# EAGLE board tides2_v40 (EAGLE 5.09)
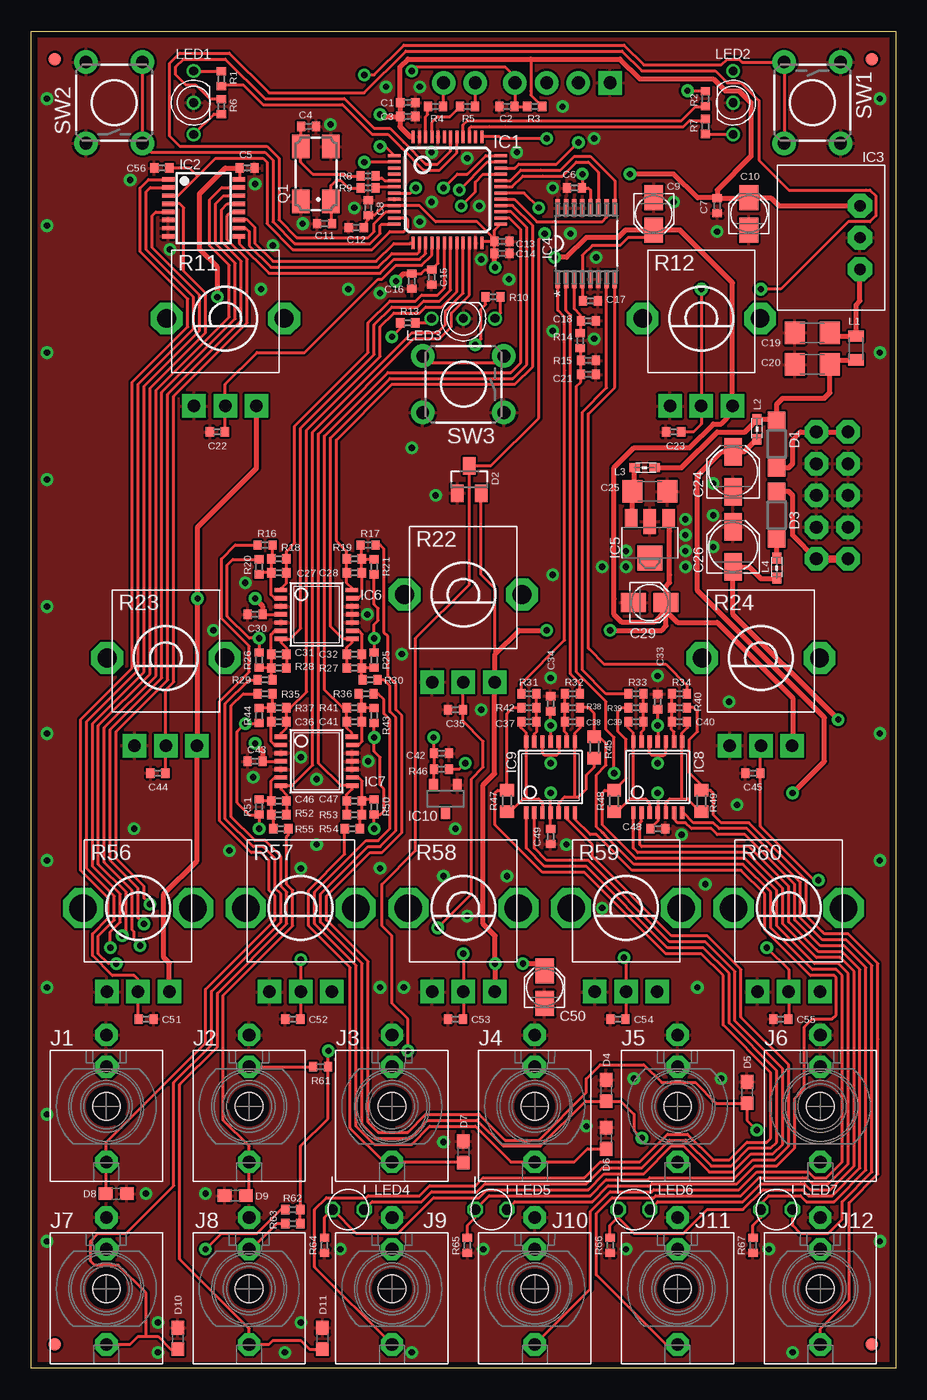
[diagram p5: board, top side]
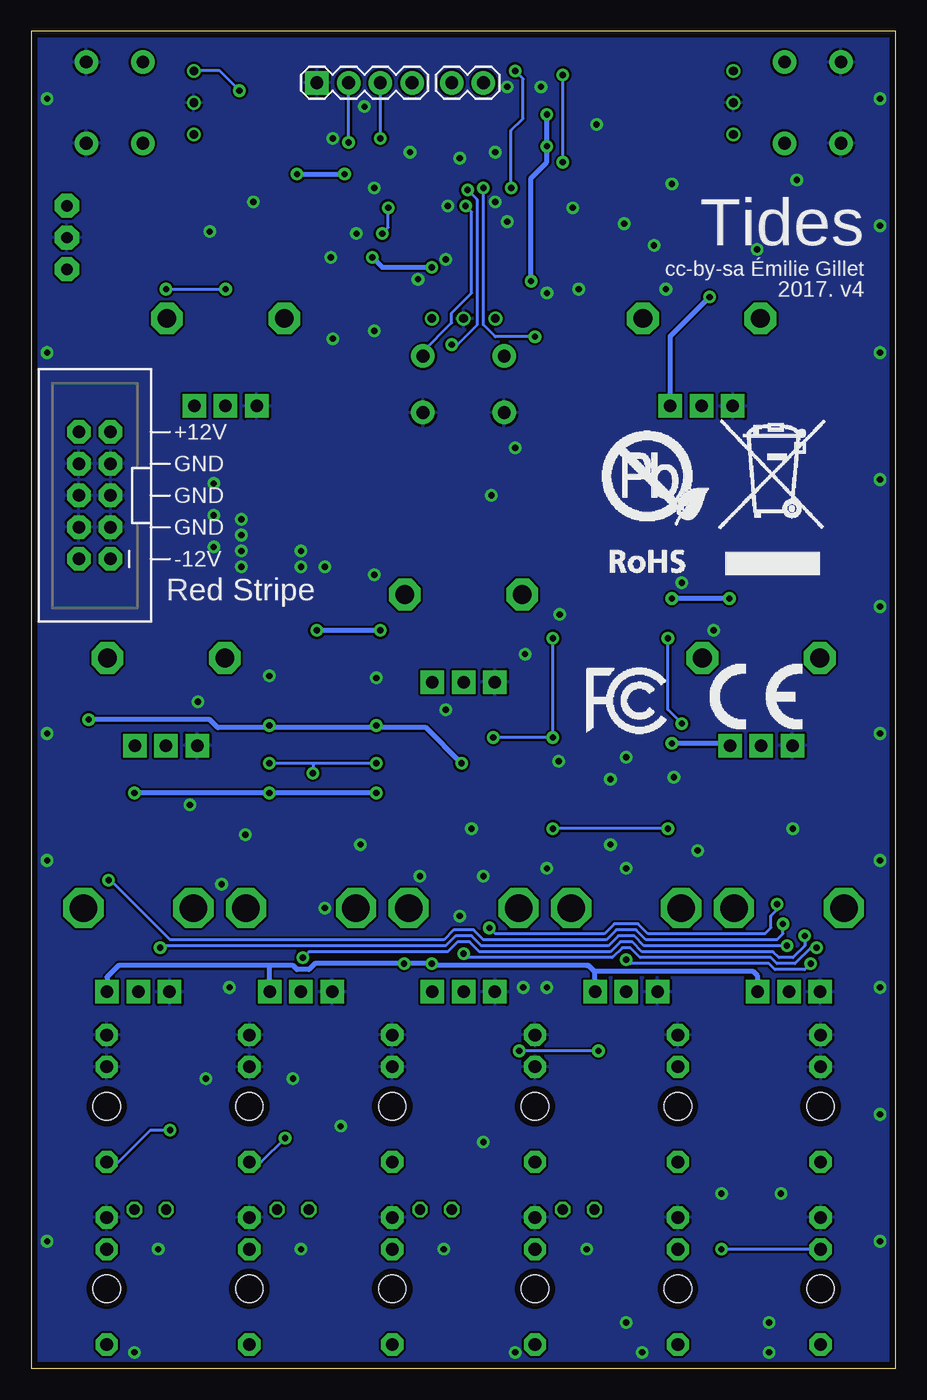
[diagram p6: board, bottom side, seen from below]

Size 69.2 x 107 mm. Coordinates in mm from the lower left corner, seen from the top.
Outline: 69.2,0 0,0 0,107 69.2,107 69.2,0
Copper layers (1*16): Top 0.035mm / dielectric 1.5mm / Bottom 0.035mm
Design rules "PCBCart-Standard": minimum track width 8mil, minimum drill 0.4mm, track to track 7mil, track to pad 7mil, pad to pad 7mil, via to via 7mil, smd to smd 7mil, copper to edge 20mil, drill to drill 8mil, minimum pad ring 8mil, minimum via ring 10mil, stop-mask expansion 3mil, vias tented up to drill 25mil, thermal gap 8mil

## Footprints (pad centres in the part's own frame; a part is rotated, then mirrored left to right if it is on the bottom)
C0402 = smd 0.65 x 0.75: 1 -0.6,0; 2 0.6,0
PANASONIC_A = smd 2 x 1.5: + 1.3,0; - -1.3,0
C1206 = smd 1.6 x 1.8: 1 -1.4,0; 2 1.4,0
PANASONIC_B = smd 2.2 x 1.4: + 1.6,0; - -1.6,0
SOD123 = smd 1.4 x 1.4: A 1.9,0; C -1.9,0
SOT23 = smd 1 x 1.4: 1 -0.95,-1.1; 2 0.95,-1.1; 3 0,1.1
0603 = smd 1.1 x 1: 1 -0.85,0; 2 0.85,0
LQFP48 = smd 0.254 x 1: 1 -2.75,-4.25; 2 -2.25,-4.25; 3 -1.75,-4.25; 4 -1.25,-4.25; 5 -0.75,-4.25; 6 -0.25,-4.25; 7 0.25,-4.25; 8 0.75,-4.25; 9 1.25,-4.25; 10 1.75,-4.25; 11 2.25,-4.25; 12 2.75,-4.25; 25 2.75,4.25; 26 2.25,4.25; 27 1.75,4.25; 28 1.25,4.25; 29 0.75,4.25; 30 0.25,4.25; 31 -0.25,4.25; 32 -0.75,4.25; 33 -1.25,4.25; 34 -1.75,4.25; 35 -2.25,4.25; 36 -2.75,4.25 | smd 1 x 0.254: 13 4.25,-2.75; 14 4.25,-2.25; 15 4.25,-1.75; 16 4.25,-1.25; 17 4.25,-0.75; 18 4.25,-0.25; 19 4.25,0.25; 20 4.25,0.75; 21 4.25,1.25; 22 4.25,1.75; 23 4.25,2.25; 24 4.25,2.75; 37 -4.25,2.75; 38 -4.25,2.25; 39 -4.25,1.75; 40 -4.25,1.25; 41 -4.25,0.75; 42 -4.25,0.25; 43 -4.25,-0.25; 44 -4.25,-0.75; 45 -4.25,-1.25; 46 -4.25,-1.75; 47 -4.25,-2.25; 48 -4.25,-2.75
TSSOP16_065 = smd 0.35 x 1: 1 -1.95,-2.825; 2 -1.3,-2.825; 3 -0.65,-2.825; 4 0,-2.825; 5 0.65,-2.825; 6 1.3,-2.825; 7 1.95,-2.825; 8 2.6,-2.825; 9 2.6,2.825; 10 1.95,2.825; 11 1.3,2.825; 12 0.65,2.825; 13 0,2.825; 14 -0.65,2.825; 15 -1.3,2.825; 16 -1.95,2.825
WE78 = drill 0.9 pad 1.93 octagon: 1 -2.54,0; 2 0,0; 3 2.54,0
SOP65P640X110-16N = smd 1.422 x 0.356: 1 -2.845,2.286; 2 -2.845,1.626; 3 -2.845,0.965; 4 -2.845,0.33; 5 -2.845,-0.33; 6 -2.845,-0.965; 7 -2.845,-1.626; 8 -2.845,-2.286; 9 2.845,-2.286; 10 2.845,-1.626; 11 2.845,-0.965; 12 2.845,-0.33; 13 2.845,0.33; 14 2.845,0.965; 15 2.845,1.626; 16 2.845,2.286
SOT89 = smd 1 x 1.5: 1 -1.499,-1.981; 3 1.499,-1.981 | smd 1 x 2: 2 0,-1.727 | smd 2 x 2: 2@1 0,1.194
TSSOP14_065 = smd 0.35 x 1: 1 -1.95,-2.845; 2 -1.3,-2.845; 3 -0.65,-2.845; 4 0,-2.845; 5 0.65,-2.845; 6 1.3,-2.845; 7 1.95,-2.845; 8 1.95,2.845; 9 1.3,2.845; 10 0.65,2.845; 11 0,2.845; 12 -0.65,2.845; 13 -1.3,2.845; 14 -1.95,2.825
DBZ_R-PDSO-G3 = smd 0.7 x 1: 1 -0.95,-1.1; 2 0.95,-1.1; 3 0,1.1
WQP_PJ_301M6 = drill 1.016 pad 1.778 octagon: P1 0,-5.715; P2 0,-3.175; P3 0,4.445 | hole 2.2: 0,0
FIDUCIAL-1X2 = smd 1 x 1: 1 0,0
2X5-SHROUDED = drill 1.016 pad 1.88 octagon: 1 -1.27,5.08; 2 1.27,5.08; 3 -1.27,2.54; 4 1.27,2.54; 5 -1.27,0; 6 1.27,0; 7 -1.27,-2.54; 8 1.27,-2.54; 9 -1.27,-5.08; 10 1.27,-5.08
1X04 = drill 1.016 pad 1.88 square: 1 0,0 | drill 1.016 pad 1.88: 2 2.54,0; 3 5.08,0; 4 7.62,0
1X02 = drill 1.016 pad 1.88: 1 0,0; 2 2.54,0
L2012C = smd 0.9 x 1.25: 1 -0.9,0; 2 1,0
0603' = smd 0.85 x 0.7: 1 -0.9,0; 2 0.7,0
LED-BICOLOR-THROUGHHOLE-2.54 = drill 0.7: 1 -2.54,0; 2 0,0; 3 2.54,0
LED3MM = drill 0.813 octagon: 1 -1.27,0; 2 1.27,0
CTS406 = smd 1.9 x 1.4: 1 -2.2,-1.2; 2 2.2,-1.2; 3 2.2,1.2; 4 -2.2,1.2
R0402 = smd 0.65 x 0.75: 1 -0.6,0; 2 0.6,0
ALPS_POT_VERTICAL_PS = drill 1 pad 1.88 square: P$1 -2.5,7; P$2 0,7; P$3 2.5,7 | drill 1.5 pad 2.54 octagon: P$4 -4.7,0; P$5 4.7,0
R0603 = smd 1 x 1.1: 1 -0.85,0; 2 0.85,0
ALPS_POT_VERTICAL = drill 1 pad 1.88 square: P$1 -2.5,6.7; P$2 0,6.7; P$3 2.5,6.7 | drill 2.2 pad 3.175 octagon: P$4 -4.4,0; P$5 4.4,0
TACTILE-PTH = drill 1.016 pad 1.88: 1 -3.251,2.261; 2 3.251,2.261; 3 -3.251,-2.261; 4 3.251,-2.261

## Placement (x,y rotation side)
C1  1u  [C0402]  30.14,101.28 0 top
C2  100n  [C0402]  38.08,100.97 180 top
C3  100n  [C0402]  30.14,100.17 0 top
C4  20p  [C0402]  22.2,99.38 180 top
C5  100n  [C0402]  17.28,96.04 0 top
C6  100n  [C0402]  43.48,94.46 180 top
C7  100n  [C0402]  54.91,93.03 270 top
C8  100n  [C0402]  26.97,92.87 90 top
C9  10u  [PANASONIC_A]  49.83,92.39 270 top
C10  10u  [PANASONIC_A]  57.45,92.39 90 top
C11  20p  [C0402]  23.47,91.6 0 top
C12  1u  [C0402]  26.02,91.28 180 top
C13  1u  [C0402]  37.68,90.17 0 top
C14  100n  [C0402]  37.68,89.22 0 top
C15  100n  [C0402]  32.05,87.31 270 top
C16  1u  [C0402]  30.46,86.99 270 top
C17  100n  [C0402]  44.75,85.41 0 top
C18  1u  [C0402]  44.59,83.82 0 top
C19  22u  [C1206]  62.53,82.87 180 top
C20  22u  [C1206]  62.53,80.33 180 top
C21  1u  [C0402]  44.59,79.53 0 top
C22  100n  [C0402]  14.9,74.93 180 top
C23  100n  [C0402]  51.41,74.93 180 top
C24  22u  [PANASONIC_B]  56.18,71.75 90 top
C25  22u  [C1206]  49.51,70.17 0 top
C26  22u  [PANASONIC_B]  56.18,65.72 90 top
C27  100p  [C0402]  19.82,63.66 0 top
C28  1.0n  [C0402]  25.86,63.66 180 top
C29  10u  [PANASONIC_A]  49.51,61.28 0 top
C30  100n  [C0402]  17.92,60.33 180 top
C31  100p  [C0402]  19.82,57.15 0 top
C32  1.0n  [C0402]  25.86,57.15 180 top
C33  100n  [C0402]  50.14,53.34 270 top
C34  100n  [C0402]  41.57,53.18 270 top
C35  100n  [C0402]  33.95,52.7 180 top
C36  100p  [C0402]  19.82,51.75 0 top
C37  47p  [C0402]  39.83,51.75 180 top
C38  47p  [C0402]  43.32,51.75 0 top
C39  47p  [C0402]  48.4,51.75 180 top
C40  47p  [C0402]  51.89,51.75 0 top
C41  1.0n  [C0402]  25.86,51.75 180 top
C42  1u  [C0402]  32.84,49.21 0 top
C43  100n  [C0402]  17.92,48.58 180 top
C44  100n  [C0402]  10.14,47.62 180 top
C45  100n  [C0402]  57.76,47.62 180 top
C46  1.0n  [C0402]  19.82,45.4 0 top
C47  1.0n  [C0402]  25.86,45.4 180 top
C48  100n  [C0402]  50.14,43.18 0 top
C49  100n  [C0402]  41.57,42.55 270 top
C50  10u  [PANASONIC_A]  41.1,30.48 90 top
C51  100n  [C0402]  9.19,27.94 0 top
C52  100n  [C0402]  20.93,27.94 180 top
C53  100n  [C0402]  33.95,27.94 180 top
C54  100n  [C0402]  46.97,27.94 180 top
C55  100n  [C0402]  59.99,27.94 180 top
C56  1.0n  [C0402]  10.46,96.04 180 top
D1  1N5819HW  [SOD123]  59.67,73.98 270 top
D2  BAT54S  [SOT23]  35.06,71.12 0 top
D3  1N5819HW  [SOD123]  59.67,68.26 270 top
D4  TVS  [0603]  46.02,22.23 270 top
D5  TVS  [0603]  57.29,22.07 270 top
D6  TVS  [0603]  46.02,18.41 270 top
D7  TVS  [0603]  34.59,17.3 270 top
D8  TVS  [0603]  6.81,13.97 180 top
D9  TVS  [0603]  16.33,13.81 0 top
D10  TVS  [0603]  11.73,2.38 270 top
D11  TVS  [0603]  23.32,2.38 270 top
IC1  STM32F373CCT6  [LQFP48]  33.32,94.3 270 top
IC2  4051PW  [TSSOP16_065]  13.79,93.19 270 top
IC3  R-78E3.3-0.5  [WE78]  66.34,90.49 90 top
IC4  DAC8164ICPW  [SOP65P640X110-16N]  44.43,90.01 90 top
IC5  LD2981ABU33  [SOT89]  49.51,66.04 180 top
IC6  MCP6004  [TSSOP14_065]  22.84,60.33 270 top
IC7  MCP6004  [TSSOP14_065]  22.84,48.58 270 top
IC8  TLV4172  [TSSOP14_065]  50.14,47.31 0 top
IC9  TLV4172  [TSSOP14_065]  41.57,47.31 0 top
IC10  LM4040B10  [DBZ_R-PDSO-G3]  33.16,45.56 180 top
J1  PJ301_THONKICONN6  [WQP_PJ_301M6]  6.01,20.95 180 top
J2  PJ301_THONKICONN6  [WQP_PJ_301M6]  17.44,20.95 180 top
J3  PJ301_THONKICONN6  [WQP_PJ_301M6]  28.87,20.95 180 top
J4  PJ301_THONKICONN6  [WQP_PJ_301M6]  40.3,20.95 180 top
J5  PJ301_THONKICONN6  [WQP_PJ_301M6]  51.73,20.95 180 top
J6  PJ301_THONKICONN6  [WQP_PJ_301M6]  63.16,20.95 180 top
J7  PJ301_THONKICONN6  [WQP_PJ_301M6]  6.01,6.35 180 top
J8  PJ301_THONKICONN6  [WQP_PJ_301M6]  17.44,6.35 180 top
J9  PJ301_THONKICONN6  [WQP_PJ_301M6]  28.87,6.35 180 top
J10  PJ301_THONKICONN6  [WQP_PJ_301M6]  40.3,6.35 180 top
J11  PJ301_THONKICONN6  [WQP_PJ_301M6]  51.73,6.35 180 top
J12  PJ301_THONKICONN6  [WQP_PJ_301M6]  63.16,6.35 180 top
JP1  FIDUCIAL1X2  [FIDUCIAL-1X2]  1.89,104.78 0 top
JP2  FIDUCIAL1X2  [FIDUCIAL-1X2]  67.29,104.77 0 top
JP3  FIDUCIAL1X2  [FIDUCIAL-1X2]  1.89,1.91 0 top
JP4  FIDUCIAL1X2  [FIDUCIAL-1X2]  67.29,1.91 0 top
JP5  M05X2SHD  [2X5-SHROUDED]  64.12,69.85 180 bottom
JP6  [1X04]  46.33,102.87 0 bottom
JP7  [1X02]  33,102.87 180 bottom
L1  33u  [L2012C]  66.02,81.6 90 top
L2  [0603']  58.08,75.25 90 top
L3  [0603']  49.19,72.07 0 top
L4  [0603']  59.67,64.14 90 top
LED1  W115WSURKMGKW  [LED-BICOLOR-THROUGHHOLE-2.54]  13,101.28 90 top
LED2  W115WSURKMGKW  [LED-BICOLOR-THROUGHHOLE-2.54]  56.18,101.28 270 top
LED3  W115WSURKMGKW  [LED-BICOLOR-THROUGHHOLE-2.54]  34.59,84.01 180 top
LED4  3BC-F  [LED3MM]  25.38,12.7 180 top
LED5  3BC-F  [LED3MM]  36.81,12.7 180 top
LED6  3BC-F  [LED3MM]  48.24,12.7 180 top
LED7  3BC-F  [LED3MM]  59.67,12.7 180 top
Q1  8MHz  [CTS406]  22.79,95.57 90 top
R1  2.4k  [R0402]  15.22,103.19 90 top
R2  1.5k  [R0402]  53.95,101.6 90 top
R3  10k  [R0402]  40.3,100.97 180 top
R4  100  [R0402]  32.36,100.97 180 top
R5  100  [R0402]  34.9,100.97 180 top
R6  1.5k  [R0402]  15.22,100.97 270 top
R7  2.4k  [R0402]  53.95,99.38 270 top
R8  100  [R0402]  26.97,95.41 180 top
R9  100  [R0402]  26.97,94.46 180 top
R10  1.5k  [R0402]  36.97,85.73 0 top
R11  10kB  [ALPS_POT_VERTICAL_PS]  15.54,84.01 180 top
R12  10kB  [ALPS_POT_VERTICAL_PS]  53.64,84.01 180 top
R13  2.4k  [R0402]  30.14,83.66 0 top
R14  130k  [R0402]  43.95,82.23 90 top
R15  100k  [R0402]  44.59,80.64 180 top
R16  100k  [R0402]  18.71,65.88 180 top
R17  100k  [R0402]  26.97,65.88 0 top
R18  20k  [R0402]  19.82,64.77 180 top
R19  20k  [R0402]  25.86,64.77 0 top
R20  120k  [R0402]  18.24,64.14 90 top
R21  120k  [R0402]  27.44,64.14 270 top
R22  10kB  [ALPS_POT_VERTICAL_PS]  34.59,61.91 180 top
R23  10kB  [ALPS_POT_VERTICAL_PS]  10.78,56.83 180 top
R24  10kB  [ALPS_POT_VERTICAL_PS]  58.4,56.83 180 top
R25  120k  [R0402]  27.44,56.67 90 top
R26  390k  [R0402]  18.24,56.67 90 top
R27  20k  [R0402]  25.86,56.04 0 top
R28  130k  [R0402]  19.82,56.04 180 top
R29  100k  [R0402]  18.71,55.09 180 top
R30  100k  [R0402]  27.13,55.09 0 top
R31  20k  [R0402]  39.83,53.98 180 top
R32  20k  [R0402]  43.32,53.98 0 top
R33  20k  [R0402]  48.4,53.98 180 top
R34  20k  [R0402]  51.89,53.98 0 top
R35  100k  [R0402]  18.71,53.97 180 top
R36  100k  [R0402]  26.81,53.97 0 top
R37  130k  [R0402]  19.82,52.86 180 top
R38  130k  [R0402]  43.32,52.86 180 top
R39  130k  [R0402]  48.4,52.86 0 top
R40  130k  [R0402]  51.89,52.86 180 top
R41  20k  [R0402]  25.86,52.86 0 top
R42  130k  [R0402]  39.83,52.86 0 top
R43  120k  [R0402]  27.44,52.23 270 top
R44  390k  [R0402]  18.24,52.23 270 top
R45  1.0k  [R0603]  45.06,49.69 270 top
R46  1.5k  [R0402]  32.84,47.94 180 top
R47  1.0k  [R0603]  38.08,45.4 270 top
R48  1.0k  [R0603]  46.65,45.4 270 top
R49  1.0k  [R0603]  53.64,45.4 270 top
R50  140k  [R0402]  27.44,44.93 270 top
R51  120k  [R0402]  18.24,44.93 270 top
R52  20k  [R0402]  19.82,44.29 180 top
R53  33k  [R0402]  25.86,44.29 0 top
R54  100k  [R0402]  25.7,43.18 180 top
R55  100k  [R0402]  19.98,43.18 0 top
R56  10kB  [ALPS_POT_VERTICAL]  8.55,36.83 180 top
R57  10kB  [ALPS_POT_VERTICAL]  21.57,36.83 180 top
R58  10kB  [ALPS_POT_VERTICAL]  34.59,36.83 180 top
R59  10kB  [ALPS_POT_VERTICAL]  47.6,36.83 180 top
R60  10kB  [ALPS_POT_VERTICAL]  60.62,36.83 180 top
R61  10k  [R0402]  23.16,24.13 0 top
R62  10k  [R0402]  20.94,12.7 0 top
R63  10k  [R0402]  20.94,11.59 0 top
R64  1.0k  [R0402]  23.48,9.84 270 top
R65  1.0k  [R0402]  34.9,9.84 270 top
R66  1.0k  [R0402]  46.33,9.84 270 top
R67  1.0k  [R0402]  57.76,9.84 270 top
SW1  [TACTILE-PTH]  62.53,101.28 270 top
SW2  [TACTILE-PTH]  6.65,101.28 90 top
SW3  [TACTILE-PTH]  34.59,78.74 180 top
U$2  [ROHS_BIG]  24.74,62.71 0 bottom
U$4  [CE_MEDIUM]  14.9,51.12 0 bottom
U$5  [FCC_MEDIUM]  24.75,50.8 0 bottom

## Tracks (layer width: path | path; a pad name or v marks a point on that pad's centre or on a via)
+3V3  (via drill 0.5)
  Top 0.254: 30.34,98.55 IC1.48 | v44.11,95.57 44.11,94.49 C6.1 44.59,94.46 44.76,94.28 IC4.12 | IC1.1 28.32,97.79 v27.92,97.79 | 30.43,87.63 C16.1 31.22,87.59 31.54,87.91 C15.1 32.57,88.43 IC1.17 | 39.98,104.78 39.98,102.23 39.98,101.88 R3.1
  Top 0.406: C7.1 54.91,94.3 57.61,97 57.61,101.28 56.65,102.23 55.54,102.23 54.59,103.19 48.72,103.19 47.13,104.78 39.98,104.78 30.14,104.78 29.51,104.14 29.51,101.32 C1.1 C3.1 | C7.1 57.38,93.63 C10.+ 57.48,93.66 59.19,93.66 59.83,93.03 IC3.3 | C3.1 29.51,100.14 29.51,99.38 30.34,98.55 | C7.1 54.87,93.66 53.32,93.66 51.41,95.57 v47.92,95.57 | v27.92,100.33 28.08,100.17 C3.1 | v29.19,87 29.79,87.59 C16.1
  Bottom 0.406: v47.92,95.57 v44.11,95.57 | v27.92,100.33 v27.92,97.79 27.92,96.52 29.19,95.25 v29.19,87
+3V3_A  (via drill 0.5)
  Top 0.254: C30.1 IC6.4 | IC1.25 37.08,91.06 C13.1 | IC1.24 36.19,90.17 C13.1 | C14.1 C13.1 | C13.1 37.08,90.38 35.7,91.76 32.36,91.76 31.09,93.03 29.09,93.03 IC1.9 28.26,93.05 27.48,92.27 C8.1 26.97,91.92 26.81,91.76 26.81,91.47 C12.1 | 44.11,87.18 IC4.4 | D2.2 36.02,63.5 37.13,62.39 37.13,55.4 | C43.1 IC7.4 | IC2.16 16.68,95.2 C5.1 | 44.11,87.18 IC4.4 | C17.1 44.1,85.45 IC4.4 | 44.11,87.18 IC4.4 | 44.11,87.18 44.11,89.06 44.91,89.85 47.13,89.85 47.76,90.49 48.88,90.49 49.83,90.49 C9.+
  Top 0.406: R24.P$1 60.94,49.87 60.94,53.66 54.91,59.69 51.73,59.69 50.81,60.61 | v46.33,59.05 | v41.25,59.05 39.03,59.05 37.13,57.15 37.13,55.4 37.13,54.95 R22.P$1 37.09,47.59 36.17,46.67 36.17,35.56 37.13,34.61 v37.13,32.38 37.13,30.17 R58.P$1 | C50.+ 40.49,32.38 v39.35,32.38 | v17.92,61.59 18.52,60.99 C30.1 | v37.13,88.11 37.08,88.15 C14.1 | R56.P$1 11.05,32.42 10.62,32.86 10.62,37.94 13.28,40.6 R23.P$1 13.32,49.87 v13.32,61.59 13.32,67.31 18.04,72.03 R11.P$1 | v14.9,85.72 14.9,88.11 13.47,89.53 13.47,93.98 15.54,96.04 C5.1 | v17.92,50.01 18.52,49.41 C43.1 | v41.89,88.9 42.84,88.9 44.43,90.49 46.97,90.49 47.57,91.09 C9.+ 51.92,91.09 56.14,86.88 R12.P$1 56.14,76.48 55.22,75.56 54.59,75.56 52.68,73.66 48.24,73.66 46.65,72.07 46.65,61.59 46.65,60.33 47.29,59.69 49.83,59.69 50.81,60.67 C29.+ | IC5.1 51.1,68.02 51.1,66.99 51.1,63.5 51.1,62.87 50.81,62.58 C29.+ | 50.81,60.61 C29.+ | v46.33,59.05 50.46,59.05 50.81,59.4 50.81,60.61
  Bottom 0.406: v41.25,59.05 v46.33,59.05 | 50.14,32.23 48.24,32.23 47.92,31.91 46.97,31.91 46.49,32.38 v39.35,32.38 v37.13,32.38 36.97,32.23 24.75,32.23 | 50.14,32.23 62.21,32.23 63.12,31.31 R60.P$1 | R59.P$1 50.14,30.17 50.14,32.23 | 18.04,61.71 v17.92,61.59 v13.32,61.59 | v17.92,50.01 | v41.89,88.9 41.1,88.11 v37.13,88.11 | v14.9,85.72 18.04,82.59 R11.P$1 | 24.11,31.75 11.41,31.75 11.05,31.39 R56.P$1 | 24.75,32.23 | 24.11,31.75 24.59,32.23 24.75,32.23 | R57.P$1 24.11,30.17 24.11,31.75 | v17.92,50.01 13.95,50.01 13.78,49.83 R23.P$1
ADC_CLOCK
  Top 0.254: IC1.20 34.07,86.16 32.84,84.93 31.57,84.93 31.09,84.45 29.03,84.45 27.92,83.34 27.92,80.96 22.05,75.09 22.05,54.13 20.78,52.86 R37.1 C36.2 20.42,51.24 20,50.81 IC7.1
ADC_FM
  Top 0.254: R52.1 C46.2 20.46,45.44 20.46,45.88 20,46.34 IC7.7 20.89,46.63 22.52,48.26 22.52,74.93 30.46,82.87 32.52,82.87 33.16,83.5 33.16,84.61 34.57,86.02 IC1.21
ADC_SHAPE
  Top 0.254: R27.1 | R27.1 C32.2 25.26,57.66 25.68,58.09 IC6.8 24.95,58.38 23.95,59.37 23.95,74.45 28.71,79.22 38.56,79.22 39.67,80.33 39.67,91.28 38.4,92.55 IC1.27
ADC_SHIFT
  Top 0.254: R19.1 25.22,64.81 | R19.1 C28.2 25.26,62.83 25.66,62.42 IC6.14 | IC1.28 38.54,93.05 40.14,91.44 40.14,80.17 38.71,78.74 28.87,78.74 24.43,74.3 24.43,66.2 25.26,65.37 R19.1
ADC_SLOPE
  Top 0.254: R18.1 20.46,64.81 | R18.1 C27.2 20.42,62.83 20,62.4 IC6.1 | IC1.18 33.07,86.43 32.52,85.88 31.25,85.88 30.78,85.41 28.71,85.41 26.97,83.66 26.97,81.28 21.25,75.56 21.09,75.41 21.09,66.04 20.42,65.37 R18.1
ADC_SMOOTHNESS
  Top 0.254: R41.1 | R41.1 24.9,52.86 23.48,54.29 23.48,74.61 28.55,79.69 38.4,79.69 39.19,80.49 39.19,91.12 38.27,92.05 IC1.26 | R41.1 | R41.1 C41.2 25.26,51.24 25.66,50.83 IC7.14
ADC_TRIG
  Top 0.254: R28.1 C31.2 20.46,57.19 20.46,57.63 20,58.09 IC6.7 20.73,58.38 21.57,59.21 21.57,75.25 27.44,81.12 27.44,83.5 28.87,84.93 30.94,84.93 31.41,85.41 32.68,85.41 33.57,86.29 IC1.19
ADC_V_OCT
  Top 0.254: R53.1 C47.2 25.26,45.91 25.68,46.34 IC7.8 24.79,46.63 23,48.42 23,74.77 30.62,82.39 32.68,82.39 33.63,83.34 33.63,84.45 35.07,85.89 IC1.22
AREF_-10  (via drill 0.5)
  Top 0.254: 18.2,44.29 R51.2 v18.24,43.18 | R20.2 16.14,64.73 15.7,64.29 15.7,60.17 17.44,58.42 v18.24,58.42 | R21.2 | R43.2 | R25.2 | R21.2 27.44,61.12 27.76,60.8 27.76,59.85 27.44,59.53 v27.44,58.42 R25.2 | R43.2 | R43.2 v27.44,50.48 27.44,49.37 27.92,48.9 27.92,46.67 28.24,46.35 28.24,44.61 27.96,44.33 R50.2 | 18.2,44.29 18.24,44.26 | 18.2,44.29 17.44,44.29 16.49,45.24 16.49,50.96 v17.12,51.59 18.2,51.59 R44.2 | v18.24,58.42 | v18.24,58.42 R26.2 | R46.2 32.21,47.91 IC10.2 | R50.2 | v27.44,43.18 R50.2 | v18.24,43.18 | R46.2 | R46.2 C42.1 32.21,49.25 v32.21,50.48
  Bottom 0.254: v27.44,58.42 | v27.44,58.42 v27.44,50.48 v32.21,50.48 | v17.12,51.59 18.24,52.7 v18.24,58.42 | v18.24,43.18 v27.44,43.18 | v27.44,43.18
CLOCK_IN
  Top 0.254: 17.76,53.98 R35.2 16.97,53.98 16.01,53.02 16.01,44.13 17.92,42.23 18.71,42.23 19.98,40.96 19.98,38.58 20.46,38.1 20.46,35.56 14.9,30 14.9,25.72 11.89,22.7 11.89,8.73 17.44,3.17 J8.P3 19.03,1.91 19.35,2.22 21.57,2.22 22.26,1.53 D11.2
DAC_1
  Top 0.254: IC4.1 42.14,84.68 42.68,84.14 42.68,79.85 | R31.2 39.23,54.8 42.68,58.26 42.68,79.85 | 42.68,79.85
DAC_2
  Top 0.254: 42.84,87.13 IC4.2 42.8,84.65 43.16,84.3 43.16,55.56 43.92,54.8 R32.2
DAC_3
  Top 0.254: R33.2 46.02,53.98 44.11,55.88 44.11,76.52 46.06,78.46 IC4.7
DAC_4
  Top 0.254: R34.2 52.49,54.65 50.78,56.36 45.86,56.36 44.67,57.55 44.59,57.63 44.59,76.36 46.72,78.49 IC4.8
DAC_MOSI
  Top 0.254: 45.38,92.87 IC4.11 45.39,95.71 44.59,96.52 43.64,96.52 42.52,95.41 40.94,95.41 39.35,95.41 38.49,94.55 IC1.31
DAC_SCK
  Top 0.254: IC1.29 38.67,93.55 40.46,91.76 45.7,91.76 46.06,92.11 IC4.10
DAC_SS
  Top 0.254: IC1.32 38.35,95.05 39.19,95.89 40.78,95.89 42.37,95.89 43.48,97 44.75,97 46.72,95.03 IC4.9
FM_IN
  Top 0.254: R55.2 20.58,42.67 20.46,42.55 20.46,38.73 20.93,38.26 20.93,35.4 15.38,29.84 15.38,19.84 17.44,17.78 J2.P3 17.44,14.07 D9.2
FREQUENCY_ATT  (via drill 0.5)
  Top 0.254: v6.81,32.38 6.17,32.38 5.38,33.18 5.38,34.61 6.65,35.88 6.65,37.78 4.43,40.01 4.43,51.75 8.55,55.88 8.55,78.74 13,83.19 13,85.72 9.19,89.53 9.19,94.14 9.54,94.49 IC2.2 | C52.1 21.57,27.98 R57.P$2 v21.57,32.7
  Bottom 0.254: v6.81,32.38 7.28,31.91 9.66,31.91 10.14,32.38 21.25,32.38 v21.57,32.7
FREQUENCY_POT
  Top 0.254: C22.1 15.54,74.97 R11.P$2 15.54,78.74 18.08,81.28 21.89,81.28 26.65,86.04 27.76,87.15 28.08,87.15 29.19,88.27 31.25,88.27 32.07,89.08 IC1.16
GND  (via drill 0.5)
  other vias: 42.84,41.91 52.05,42.7 45.06,82.39 41.57,55.24 50.14,55.4 54.59,70.8 54.59,68.26 47.6,64.14 10.14,3.65 21.57,3.65 9.19,13.97 13.95,13.97 33,18.1 55.22,23.18 36.17,9.53 47.6,9.53 59.03,9.53 44.43,19.37 48.24,23.18 26.9,60.33 26.97,48.58 15.86,41.43 21.57,40.01 33,39.37 38.08,39.37 53.32,30.48 45.7,36.83 17.76,47.31 17.12,62.87 21.57,48.9 22.84,47.15 22.84,41.91 54.59,65.72 29.82,30.48 27.92,30.48 33.95,43.18 56.49,45.09 41.73,63.5 45.7,64.14 29.67,57.15 24.75,9.53 1.25,101.6 1.25,91.44 1.25,81.28 1.25,71.12 1.25,60.96 1.25,50.8 1.25,40.64 1.25,30.48 1.25,20.32 1.25,10.16 10.14,1.27 20.3,1.27 30.46,1.27 60.94,1.27 67.92,10.16 67.92,40.64 67.92,50.8 67.92,81.28 67.92,101.6 30.46,73.66 41.73,94.46 11.09,89.53 32.36,69.85 8.24,43.18 53.95,38.73 55.86,53.34 34.9,36.2 36.02,52.7 14.59,59.05 36.02,88.74 27.92,86.04 17.92,94.77 51.41,93.35 23.95,99.54 21.73,91.6 31.09,102.55 32.05,93.34 34.9,96.84 38.87,97.31 45.06,98.42 42.52,100.97 35.86,93.03 27.92,40 38.24,87.15 32.05,97.31 25.38,86.36 41.73,83.03 43.16,90.81 54.91,90.96 25.86,92.87 28.4,102.55 31.09,91.76 18.39,86.36 45.22,88.9 19.35,89.85 52.37,67.94 52.37,66.67 52.37,65.41 52.37,64.14 47.6,65.41 7.92,95.09
  pour Top: 69.2,107 69.2,0 -0.02,0 -0.02,107
  pour Bottom: 69.2,107 69.2,0 -0.02,0 -0.02,107
LED_MODE_G  (via drill 0.5)
  Top 0.254: v35.54,81.92 36.02,82.39 36.02,84.77 36.37,85.12 R10.1 | v34.27,94.3 36.52,96.55 IC1.35
  Bottom 0.254: v34.27,94.3 33.48,93.5 33.48,83.5 35.06,81.92 v35.54,81.92
LED_MODE_R  (via drill 0.5)
  Top 0.254: v28.87,82.55 29.54,83.22 R13.1 | v33,94.46 34.11,95.57 34.9,95.57 36.38,97.05 IC1.36
  Bottom 0.254: v33,94.46 33,83.5 32.05,82.55 v28.87,82.55
LED_RANGE_G
  Top 0.254: R6.1 15.19,101.6 14.27,101.6 13.16,102.71 12.36,102.71 11.57,103.5 11.57,104.14 12.2,104.78 15.54,104.78 18.71,101.6 25.06,101.6 27.44,99.22 28.71,99.22 29.82,98.11 | 33.57,97.88 IC1.42 33.57,97.41 32.52,96.36 31.57,96.36 29.82,98.11 | 29.82,98.11
LED_RANGE_R
  Top 0.254: R1.1 15.34,102.71 16.97,102.71 18.55,101.12 24.9,101.12 27.29,98.74 28.55,98.74 29.67,97.63 | 29.67,97.63 | 29.67,97.63 31.41,95.89 32.68,95.89 34.07,97.27 IC1.41
LED_SHIFT_G
  Top 0.254: R2.1 53.92,100.97 53.32,100.97 53.16,100.97 52.05,99.85 34.9,99.85 34.57,99.52 IC1.40
LED_SHIFT_R
  Top 0.254: R7.1 53.83,99.85 52.68,99.85 52.21,99.38 37.92,99.38 36.65,99.38 35.22,99.38 35.07,99.22 IC1.39
MUX_ADDR_0
  Top 0.254: IC2.11 16.65,91.92 17.28,91.92 17.92,91.28 17.92,90.01 19.35,88.58 27.6,88.58 29.03,90.01 30.3,90.01 30.34,90.05 IC1.13
MUX_ADDR_1
  Top 0.254: 16.66,91.28 IC2.10 17.17,91.24 17.44,90.96 17.44,89.85 19.19,88.11 27.76,88.11 28.87,89.22 30.94,89.22 31.07,89.35 IC1.14
MUX_ADDR_2
  Top 0.254: IC1.15 31.57,89.21 | IC2.9 16.65,90.55 16.65,90.01 19.03,87.63 27.92,87.63 29.03,88.74 31.09,88.74 31.57,89.21 | 31.57,89.21
MUXED_POTS
  Top 0.254: 10.98,93.82 IC2.3 11.74,93.84 13.39,95.49 | IC1.11 30.01,92.05 30.14,91.92 30.14,91.28 29.82,90.96 28.71,90.96 27.29,89.53 20.93,89.53 18.87,91.6 18.87,96.52 18.55,96.84 14.74,96.84 13.39,95.49 | C56.1 12.68,96.04 13.24,95.49 13.39,95.49
N$1
  Top 0.406: C19.1 64.2,82.6 L1.2 66.02,85.09 66.34,85.41 IC3.1
N$2  (via drill 0.5)
  Top 0.254: R62.1 19.98,12.7 18.08,10.79 15.22,10.79 v13.95,9.53
  Bottom 0.254: J7.P2 v13.95,9.53
N$3
  Top 0.254: R63.1 | R63.1 19.66,11.59 17.6,9.53 J8.P2
N$4
  Top 0.254: R16.1 19.31,64.86 R18.2 C27.1 | R20.1 18.36,63.66 C27.1 | C27.1 19.19,63.62 19.19,61.91 19.48,61.62 IC6.2
N$7
  Top 0.254: R8.1 27.73,95.25 28.08,95.25 28.28,95.05 IC1.5
N$8
  Top 0.254: R9.1 27.66,94.55 IC1.6
N$16
  Top 0.254: LED1.3 13.03,103.79 R1.2
N$18
  Top 0.254: LED3.3 31.7,83.66 R13.2
N$20
  Top 0.254: LED3.1 37.57,84.45 R10.2
N$21
  Top 0.254: LED2.3 56.14,98.78 R7.2
N$22
  Top 0.254: LED1.1 14.62,100.36 R6.2
N$23  (via drill 0.5)
  Top 0.254: R2.2 53.92,102.23 v52.53,102.23
  Bottom 0.254: v52.53,102.23 54.11,103.82 LED2.1
N$26
  Top 0.254: J2.P2 R61.1
N$28
  Top 0.254: R17.1 26.46,65.79 R19.2 | R21.1 27.6,64.89 27.6,64.93 27.44,64.77 R19.2 | R19.2 C28.1 26.49,63.62 26.49,61.91 26.2,61.62 IC6.13
N$29
  Top 0.254: R8.2 25.22,95.41 25.06,95.57 22.52,95.57 21.57,96.52 21.57,97.75 Q1.3 21.61,97.79 C4.2
N$30
  Top 0.254: R54.1 26.3,44.13 R53.2 C47.1 26.49,45.44 | 26.49,45.44 26.49,46.99 26.2,47.28 IC7.9 | 26.49,45.44 26.58,45.53 R50.1
N$32
  Top 0.254: R55.1 19.38,44.13 R52.2 C46.1 | R51.1 18.36,45.4 C46.1 | C46.1 19.19,45.44 19.19,46.99 19.48,47.28 IC7.6
N$33
  Top 0.254: R5.1 35.54,101 JP7.2
N$34
  Top 0.254: R29.1 19.22,55.17 R28.2 | R26.1 18.27,56.04 R28.2 | R28.2 C31.1 19.19,57.19 19.19,58.74 19.48,59.02 IC6.6
N$35
  Top 0.254: R9.2 | R9.2 25.38,94.46 24.75,95.09 24.43,95.09 23.99,94.65 Q1.1 23.99,91.68 C11.2
N$37
  Top 0.254: R30.1 26.46,55.16 R27.2 | R27.2 | R27.2 C32.1 26.49,57.19 26.49,58.74 26.2,59.02 IC6.9 | R27.2 26.49,56.07 R25.1
N$38
  Top 0.406: L4.2 D3.A
N$39
  Top 0.254: R37.2 19.31,52.95 R35.1 | R37.2 19.19,52.83 R44.1 | R37.2 C36.1 19.19,51.72 19.19,50.16 19.48,49.88 IC7.2
N$40
  Top 0.406: L1.1 64.3,80.7 C20.1 63.93,78.08 63.48,77.63 60.15,77.63 59.67,77.15 D1.C 59.6,75.95 58.15,75.95 | 58.15,75.95 L2.2 58.15,75.95 | 58.15,75.95 57.13,74.93 54.91,74.93 52.05,72.07 L3.2
N$41
  Top 0.254: R41.2 26.53,52.93 | R43.1 27.41,52.86 R41.2 | R41.2 | R41.2 C41.1 26.49,51.72 26.49,50.16 26.2,49.88 IC7.13 | R36.1 26.46,53.73 R41.2
N$42
  Top 0.406: L3.1 48.29,70.35 C25.1 48.11,68.02 IC5.3
N$45
  Top 0.254: 39.67,45.56 40.62,45.56 40.92,45.26 IC9.3 | R47.2 38.34,44.55 39.35,45.56 39.67,45.56 | 39.67,45.56 39.62,45.61 IC9.14 39.62,50.84 39.19,51.28 39.19,51.72 C37.2
N$49
  Top 0.254: R39.1 47.29,52.86 46.97,52.55 46.97,50.96 47.6,50.32 47.6,47.2 R48.1 45.91,46.25 45.7,46.04 45.7,45.88 45.7,45.72 45.7,43.5 48.4,40.8 57.13,40.8 59.67,38.26 59.67,35.4 62.53,32.54 62.69,32.38 | 62.69,32.38 | 62.69,32.38 64.59,32.38 65.39,31.59 65.39,16.51 65.39,16.35 63.8,14.76 62.53,14.76 62.05,15.24 61.73,15.24 58.24,15.24 56.81,13.81 49.99,13.81 49.83,13.65 49.67,13.65 46.49,13.65 45.22,12.38 45.22,11.75 45.22,11.27 45.22,7.46 50.78,1.91 J11.P3
N$51
  Top 0.254: R4.1 33,101 JP7.1
N$53
  Top 0.254: J9.P3 22.68,8.1 22.68,12.7 23.63,13.65 26.81,13.65 26.97,13.81 31.09,13.81 31.89,14.61 35.54,14.61 36.17,15.24 44.27,15.24 45.54,16.51 48.72,16.51 50.94,18.73 52.53,18.73 54.59,16.67 55.86,16.67 57.29,18.1 58.88,18.1 59.19,18.41 59.19,20 | 59.19,20 59.19,23.65 55.38,27.46 55.38,31.43 53.64,33.18 50.78,33.18 44.27,39.69 40.94,39.69 37.13,43.5 37.13,46.04 37.34,46.25 R47.1 38.08,52.39 38.56,52.86 R42.1 | 59.19,20
N$54
  Top 0.254: R33.1 R39.2 C39.1 49.03,51.72 49.03,51.12 48.84,50.93 IC8.13
N$56
  Top 0.406: D1.A 60.62,72.07 60.94,72.39 60.94,74.3 61.57,74.93 JP5.9 JP5.10
N$58
  Top 0.254: J12.P3 63.16,3.17 65.46,5.48 65.46,13.26 67.77,15.56 67.77,26.35 67.77,32.38 65.39,34.77 63.48,34.77 63.32,34.92 62.05,36.2 62.05,39.05 57.45,43.66 55.22,43.66 54.59,44.29 54.59,46.04 54.38,46.25 R49.1 53.64,46.67 52.68,47.62 52.68,50.32 53.32,50.96 53.32,52.55 53,52.86 R40.1
N$59
  Top 0.254: R34.1 R40.2 C40.1 51.26,51.72 51.26,51.12 51.45,50.93 IC8.9
N$60
  Top 0.254: R38.2 R32.1 | R38.2 | R38.2 C38.1 42.68,51.72 42.68,50.96 42.87,50.77 IC9.9
N$61
  Top 0.254: R42.2 | R42.2 R31.1 | IC9.13 40.27,50.77 40.46,50.96 40.46,51.72 C37.1 R42.2
N$63
  Top 0.254: J10.P3 44.75,6.35 44.75,12.38 44.75,12.54 46.33,14.13 49.67,14.13 49.83,14.29 56.65,14.29 58.08,15.72 61.89,15.72 62.21,15.72 62.69,15.24 63.64,15.24 64.91,16.51 | R38.1 44.59,52.86 45.06,52.39 R45.1 45.48,50.54 46.02,50.01 46.02,48.26 45.22,47.47 45.22,46.51 45.22,43.81 45.22,43.34 45.7,42.86 46.02,42.55 48.24,40.32 56.97,40.32 59.19,38.1 59.19,35.24 62.37,32.07 62.53,31.91 64.43,31.91 64.91,31.43 64.91,31.27 64.91,16.51 | 64.91,16.51
N$64
  Top 0.406: JP5.1 60.94,66.67 60.94,69.85 60.63,70.16 D3.C
  Top 0.61: JP5.1 JP5.2
N$67
  Top 0.254: IC9.2 40.27,41.62 41.25,40.64 44.59,40.64 51.1,34.13 53.95,34.13 56.34,31.75 56.34,27.78 60.15,23.97 60.15,17.94 59.35,17.14 57.61,17.14 56.18,15.72 54.27,15.72 52.21,17.78 51.26,17.78 49.03,15.56 45.86,15.56 44.59,14.29 36.49,14.29 35.86,13.65 32.21,13.65 29.35,10.79 26.02,10.79 LED4.2 23.48,12.06 R64.1
N$68
  Top 0.254: LED4.1 27.29,13.34 31.25,13.34 32.05,14.13 35.7,14.13 36.33,14.76 44.43,14.76 45.7,16.03 48.88,16.03 51.1,18.26 52.37,18.26 54.43,16.19 56.02,16.19 57.45,17.62 59.19,17.62 59.67,18.1 59.67,23.81 55.86,27.62 55.86,31.59 53.8,33.66 50.94,33.66 44.43,40.16 41.1,40.16 39.62,41.64 IC9.1
N$70
  Top 0.254: 43.48,45.72 42.68,45.72 42.22,45.26 IC9.5 | 43.48,45.72 43.79,45.72 44.43,46.35 44.43,47.47 45.06,48.1 R45.2 | 43.48,45.72 43.52,45.77 IC9.8 43.52,50.84 43.95,51.28 43.95,51.72 C38.2
N$71
  Top 0.254: R65.1 34.9,11.43 35.54,12.06 LED5.2 36.65,13.81 44.75,13.81 46.02,15.08 49.35,15.08 49.51,15.24 56.34,15.24 57.76,16.67 59.51,16.67 60.62,17.78 60.62,24.29 56.81,28.1 56.81,31.91 54.11,34.61 51.26,34.61 44.91,40.96 44.91,41.91 42.87,43.94 IC9.6
N$72
  Top 0.254: IC9.7 43.52,43.93 44.75,42.7 45.22,42.7 48.08,39.85 56.81,39.85 58.72,37.94 58.72,35.08 62.37,31.43 64.27,31.43 64.43,31.27 64.43,28.26 64.12,27.94 62.53,27.94 61.89,27.3 61.89,22.38 61.1,21.59 61.1,17.62 59.67,16.19 57.92,16.19 56.49,14.76 49.67,14.76 49.51,14.61 46.18,14.61 44.91,13.34 38.71,13.34 LED5.1 | LED5.1
N$73
  Top 0.254: 48.24,45.56 49.19,45.56 49.49,45.26 IC8.3 | R48.2 46.91,44.55 47.92,45.56 48.24,45.56 | 48.24,45.56 48.2,45.61 IC8.14 48.2,50.84 47.76,51.28 47.76,51.72 C39.2
N$74
  Top 0.254: 48.88,41.75 48.72,41.91 48.72,43.66 48.84,43.78 IC8.2 | R66.1 46.33,11.43 46.97,12.06 | 46.97,12.06 LED6.2 | 48.88,41.75 | 48.88,41.75 57.45,41.75 60.62,38.58 60.62,35.72 62.84,33.5 63,33.34 64.91,33.34 66.34,31.91 66.34,16.03 64.12,13.81 62.21,13.81 61.73,14.29 58.56,14.29 56.97,12.7 54.11,12.7 52.21,10.79 48.24,10.79 46.97,12.06
N$75
  Top 0.254: LED6.1 50.14,13.34 56.97,13.34 58.4,14.76 61.57,14.76 61.89,14.76 62.37,14.29 63.96,14.29 65.86,16.19 65.86,16.35 65.86,31.75 64.75,32.86 62.84,32.86 62.69,33.02 60.15,35.56 60.15,38.42 57.29,41.27 48.56,41.27 48.2,41.64 IC8.1
N$76
  Top 0.254: 52.05,45.56 51.1,45.56 50.79,45.26 IC8.5 | R49.2 53.53,44.55 52.53,45.56 52.05,45.56 | 52.05,45.56 52.09,45.61 IC8.8 52.09,50.84 52.53,51.28 52.53,51.72 C40.2
N$77
  Top 0.254: R67.1 57.76,11.43 58.4,12.06 LED7.2 58.4,13.18 59.03,13.81 61.57,13.81 62.05,13.34 64.27,13.34 66.81,15.88 66.81,32.07 65.07,33.81 63.16,33.81 61.1,35.88 61.1,38.73 57.13,42.7 54.91,42.7 54.43,43.18 52.84,43.18 52.37,43.66 51.73,43.66 51.45,43.94 IC8.6
N$78
  Top 0.254: LED7.1 60.94,11.43 61.57,10.79 63.8,10.79 64.91,11.91 64.91,13.34 67.29,15.72 67.29,32.23 65.23,34.29 63.32,34.29 61.57,36.04 61.57,38.89 57.29,43.18 55.07,43.18 54.59,43.66 53,43.66 52.2,44.46 IC8.7
NORMALIZATION_PROBE  (via drill 0.5)
  Top 0.254: R63.2 R62.2 21.57,12.73 21.57,17.78 23.76,19.97 R61.2 23.76,25.36 v23.79,25.4 | v30.14,25.4 30.14,27.94 28.87,29.21 28.87,34.61 28.08,35.4 28.08,38.73 30.78,41.43 30.78,58.42 35.06,62.71 D2.3 36.8,72.22 40.62,76.04 40.62,90.33 v41.1,90.81 | v40.62,92.87 39.44,94.05 IC1.30
  Bottom 0.254: v23.79,25.4 v30.14,25.4 | v41.1,90.81 40.62,91.28 v40.62,92.87
RESET  (via drill 0.5)
  Top 0.254: v30.78,94.46 30.37,94.05 IC1.7 | C2.1 38.71,101 JP6.4 38.71,103.35 37.92,104.14 30.78,104.14 v30.46,103.82 | C2.1 | C2.1 R3.2
  Bottom 0.254: v30.78,94.46 30.78,99.06 29.82,100.01 29.82,103.19 v30.46,103.82
RX
  Top 0.254: R4.2 31.73,100.93 31.73,100.33 31.57,100.17 IC1.46
SHAPE_ATT  (via drill 0.5)
  Top 0.254: v7.28,34.61 7.6,34.92 7.6,38.1 5.38,40.32 5.38,51.44 9.51,55.56 9.51,78.42 13.95,82.87 13.95,86.04 12.2,87.79 12.2,92.87 11.89,93.19 IC2.4 | v47.45,32.86 47.6,32.7 R59.P$2 47.6,27.98 C54.1
  Bottom 0.254: v7.28,34.61 7.28,33.81 8.24,32.86 9.35,32.86 9.82,33.34 20.3,33.34 21.09,34.13 22.05,34.13 22.84,33.34 33.32,33.34 34.11,34.13 35.06,34.13 35.86,33.34 46.97,33.34 v47.45,32.86 | v47.45,32.86
SHAPE_IN  (via drill 0.5)
  Top 0.254: v48.88,18.41 48.24,19.05 48.24,20.32 47.18,21.38 D4.2 44.37,21.38 40.78,17.78 37.76,17.78 35.7,19.84 31.73,19.84 30.3,18.41 27.6,18.41 26.49,19.53 26.49,32.38 23.16,35.72 23.16,37.94 26.97,41.75 27.92,41.75 29.19,43.02 29.19,52.07 28.71,52.55 28.71,54.61 28.24,55.09 R30.2
  Bottom 0.254: J5.P3 50.78,16.51 v48.88,18.41
SHAPE_POT  (via drill 0.5)
  Top 0.254: C23.1 53,74.93 53.64,75.56 R12.P$2 v53.64,86.36 | IC1.10 28.4,92.55 27.44,91.6 27.44,90.96 26.97,90.49 21.25,90.49 19.82,91.92 19.82,96.84 18.87,97.79 11.89,97.79 11.09,98.58 11.09,104.46 11.89,105.25 15.86,105.25 19.03,102.08 26.65,102.08 29.98,105.41 47.29,105.41 48.88,103.82 54.75,103.82 55.7,102.87 56.81,102.87 58.24,101.44 58.24,96.68 60.62,94.3 66.81,94.3 67.13,94.3 67.61,93.82 67.61,92.23 67.13,91.76 65.39,91.76 59.99,86.36 v58.4,86.36
  Bottom 0.254: v58.4,86.36 v53.64,86.36
SHIFT_ATT  (via drill 0.5)
  Top 0.254: v8.71,33.81 8.24,34.29 8.24,34.92 8.08,35.08 8.08,38.26 5.85,40.48 5.85,51.28 9.98,55.4 9.98,78.26 15.86,84.14 15.86,88.27 14.27,89.85 14.27,93.5 | v58.88,33.66 60.62,31.91 R60.P$2 60.62,27.98 C55.1 | 14.27,93.5 15.25,94.49 IC2.15 | 14.27,93.5
  Bottom 0.254: v58.88,33.66 58.72,33.81 36.02,33.81 35.22,34.61 33.95,34.61 33.16,33.81 23,33.81 22.21,34.61 20.93,34.61 20.14,33.81 v8.71,33.81
SHIFT_IN  (via drill 0.5)
  Top 0.254: 28.24,58.9 28.24,65.56 27.92,65.88 R17.2 | 28.24,58.9 | 28.24,58.9 28.55,58.58 28.55,55.4 29.19,54.77 29.19,52.7 29.67,52.23 29.67,42.86 28.08,41.27 27.13,41.27 23.63,37.78 23.63,35.88 26.97,32.54 26.97,19.68 27.76,18.89 30.14,18.89 31.57,20.32 35.86,20.32 37.92,18.26 40.62,18.26 44.43,22.07 44.43,23.18 45.54,24.29 49.03,24.29 50.46,22.86 53.16,22.86 54.8,21.22 D5.2 57.29,19.84 v58.08,19.05
  Bottom 0.254: J6.P3 62.21,16.51 59.67,19.05 v58.08,19.05
SHIFT_POT  (via drill 0.5)
  Top 0.254: v63,39.05 62.69,39.05 58.36,43.37 C45.1 58.36,49.8 R24.P$2 | v9.03,35.56 8.55,36.04 8.55,38.42 6.33,40.64 6.33,51.12 10.46,55.24 10.46,78.11 16.33,83.98 16.33,88.42 14.74,90.01 | 14.74,90.01 14.74,93.19 15.39,93.84 IC2.14 | 14.74,90.01
  Bottom 0.254: v63,39.05 62.84,39.05 58.08,34.29 36.17,34.29 35.38,35.08 33.79,35.08 33,34.29 23.16,34.29 22.36,35.08 20.78,35.08 19.98,34.29 9.51,34.29 9.03,34.77 v9.03,35.56
SLOPE_ATT
  Top 0.254: C51.1 8.55,27.98 R56.P$2 8.55,31.11 8.24,31.43 6.49,31.43 4.9,33.02 4.9,34.77 6.17,36.04 6.17,37.62 3.95,39.85 3.95,51.91 8.08,56.04 8.08,78.9 12.52,83.34 12.52,85.57 8.71,89.38 8.71,94.46 9.39,95.14 IC2.1
SLOPE_IN
  Top 0.254: R16.2 16.33,65.88 15.22,64.77 15.22,60.01 17.44,57.78 17.44,55.72 15.06,53.34 15.06,43.81 17.6,41.27 18.39,41.27 19.03,40.64 19.03,38.26 19.51,37.78 19.51,35.88 13.95,30.32 13.95,26.04 6.01,18.1 J1.P3 6.01,14.03 D8.2
SLOPE_POT
  Top 0.254: C44.1 10.78,47.66 R23.P$2 10.78,54.29 11.41,54.93 11.41,77.79 17.28,83.66 17.28,88.74 15.7,90.33 15.7,92.23 16,92.54 IC2.12
SMOOTHNESS_ATT  (via drill 0.5)
  Top 0.254: v6.33,33.66 6.33,34.92 7.12,35.72 7.12,37.94 4.9,40.16 4.9,51.59 9.03,55.72 9.03,78.58 13.47,83.03 13.47,85.88 9.66,89.69 9.66,92.23 9.97,92.54 IC2.5 | v34.59,33.18 R58.P$2 34.59,27.98 C53.1
  Bottom 0.254: v6.33,33.66 6.81,33.66 8.08,32.38 9.51,32.38 9.98,32.86 20.46,32.86 21.25,33.66 21.89,33.66 22.68,32.86 34.27,32.86 v34.59,33.18
SMOOTHNESS_IN
  Top 0.254: R36.2 27.76,53.98 28.24,53.5 28.24,52.39 28.71,51.91 28.71,43.18 27.76,42.23 26.81,42.23 22.68,38.1 22.68,35.56 26.02,32.23 26.02,19.37 27.44,17.94 30.46,17.94 31.89,19.37 35.54,19.37 38.4,16.51 J4.P3 43.48,16.51 44.53,17.57 D6.2
SMOOTHNESS_POT  (via drill 0.5)
  Top 0.254: v32.52,35.24 35.22,37.94 35.22,47.15 36.17,48.1 36.17,50.16 34.55,51.79 C35.1 34.55,54.88 R22.P$2 | v9.51,37.15 9.03,37.62 9.03,38.58 6.81,40.8 6.81,50.96 10.93,55.09 10.93,77.95 16.81,83.82 16.81,88.58 15.22,90.17 15.22,92.71 15.7,93.19 IC2.13
  Bottom 0.254: v32.52,35.24 32.05,34.77 23.32,34.77 22.52,35.56 20.62,35.56 19.82,34.77 10.46,34.77 9.98,35.24 9.98,36.2 9.51,36.67 v9.51,37.15
SW_MODE  (via drill 0.5)
  Top 0.254: v34.43,93.03 35.2,93.8 35.54,94.14 35.54,94.93 36.15,95.55 IC1.33 | SW3.4 31.85,80.49 37.45,80.49 37.84,80.88 SW3.3
  Bottom 0.254: v34.43,93.03 34.27,92.87 33.95,92.55 33.95,86.04 35.54,84.45 35.54,83.66 37.84,81.36 SW3.3
SW_RANGE
  Top 0.254: SW2.4 SW2.3 9.63,97.31 18.71,97.31 19.35,96.68 19.35,91.76 21.09,90.01 27.13,90.01 27.92,90.81 27.92,91.44 28.03,91.55 IC1.12
SW_SHIFT  (via drill 0.5)
  Top 0.254: SW1.4 SW1.3 56.89,104.53 56.65,104.78 55.7,104.78 55.22,104.3 49.03,104.3 47.45,105.89 29.82,105.89 27.44,103.5 v26.65,103.5 | v26.65,96.52 26.68,96.55 IC1.2
  Bottom 0.254: SW1.3 60.27,103.94 | v26.65,96.52 v26.65,103.5
SWCLK  (via drill 0.5)
  Top 0.254: IC1.37 36.1,98.58 37.45,98.58 37.6,98.42 v41.25,98.42
  Bottom 0.254: v41.25,98.42 JP6.3
SWDIO  (via drill 0.5)
  Top 0.254: v43.79,98.11 42.05,96.36 39.03,96.36 38.72,96.05 IC1.34
  Bottom 0.254: v43.79,98.11 JP6.2
TRIG_IN
  Top 0.254: 19.98,37.94 19.98,35.72 14.43,30.16 14.43,25.88 11.41,22.86 11.41,14.61 7.6,10.79 5.38,10.79 4.74,10.16 4.74,8.57 5.06,8.26 6.97,8.26 9.19,6.03 9.19,2.54 | 19.98,37.94 | 19.98,37.94 19.51,38.42 19.51,40.8 18.55,41.75 17.76,41.75 15.54,43.97 15.54,53.18 17.44,55.09 R29.2 | 11.35,1.91 D10.2 11.15,1.53 10.14,2.54 9.19,2.54 | J7.P3 7.92,1.91 8.55,2.54 9.19,2.54
TX
  Top 0.254: R5.2 33.51,100.17 32.52,100.17 32.07,99.72 IC1.45
V_OCT_IN
  Top 0.254: 25.1,43.22 R54.2 25.1,41.15 22.21,38.26 22.21,35.4 25.54,32.07 25.54,19.21 28.24,16.51 J3.P3 34.53,16.51 D7.2
VCC  (via drill 0.5)
  Top 0.254: v41.57,46.04 IC9.4 C49.1 | v50.14,46.04 IC8.4 50.14,43.78 C48.1
  Top 0.406: v60.94,46.04 63.48,48.58 63.48,52.07 53.32,62.23 53.32,71.44 55.24,73.36 C24.+ 57.08,73.34 L2.1
  Bottom 0.406: v41.57,46.04 v50.14,46.04 v60.94,46.04
VEE  (via drill 0.5)
  Top 0.254: C34.2 v41.57,51.44 IC9.11 | IC8.11 v50.14,51.44 C33.2 | R46.1 | R46.1 34.27,47.94 v34.75,48.42
  Top 0.406: 64.12,52.39 | v64.59,51.91 64.12,52.39 | 64.12,52.39 56.18,60.33 C26.- | L4.1 59.6,63.17 59.59,63.18 58.4,63.18 57.46,64.12 C26.- | C26.- 56.24,64.19
  Bottom 0.406: 50.14,51.28 v50.14,51.44 | 50.14,51.28 54.27,51.28 54.91,51.91 v64.59,51.91 | v34.75,48.42 37.6,51.28 41.57,51.28 | 41.57,51.28 50.14,51.28 | 41.57,51.28 v41.57,51.44
VREF
  Top 0.254: R14.2 43.99,82.87 C18.1 43.95,83.86 43.95,84.3 43.46,84.78 IC4.3
VREF_BIAS  (via drill 0.5)
  Top 0.254: 41.57,49.05 41.1,49.05 40.92,49.23 IC9.12 | 41.57,49.05 v41.57,48.42 | v46.65,47.62 46.65,50.48 46.02,51.12 46.02,53.34 43.64,55.72 43.64,78.58 43.99,78.93 C21.1 | 41.57,49.05 42.05,49.05 42.22,49.23 IC9.10 | 50.14,49.05 49.67,49.05 49.49,49.23 IC8.12 | v50.14,48.42 50.14,49.05 | 50.14,49.05 50.62,49.05 50.79,49.23 IC8.10 | R14.1 43.99,81.6 R15.2 C21.1 | C21.1
  Bottom 0.254: v41.57,48.42 46.65,48.42 | v50.14,48.42 | v50.14,48.42 | 46.65,48.42 v46.65,47.62 | 46.65,48.42 v50.14,48.42

## Text on the board
bNames: Tides | cc-by-sa Émilie Gillet | 2017. v4 | +12V | GND | GND | GND | -12V | Red Stripe
tStop: cc-by-sa | Émilie Gillet | 2017. v4 | Tides